# Altium project PCB_15122020_01BC.PrjPcb (part 7 of 9)

## Sheet PORT_EXPANDER.SchDoc
size A3
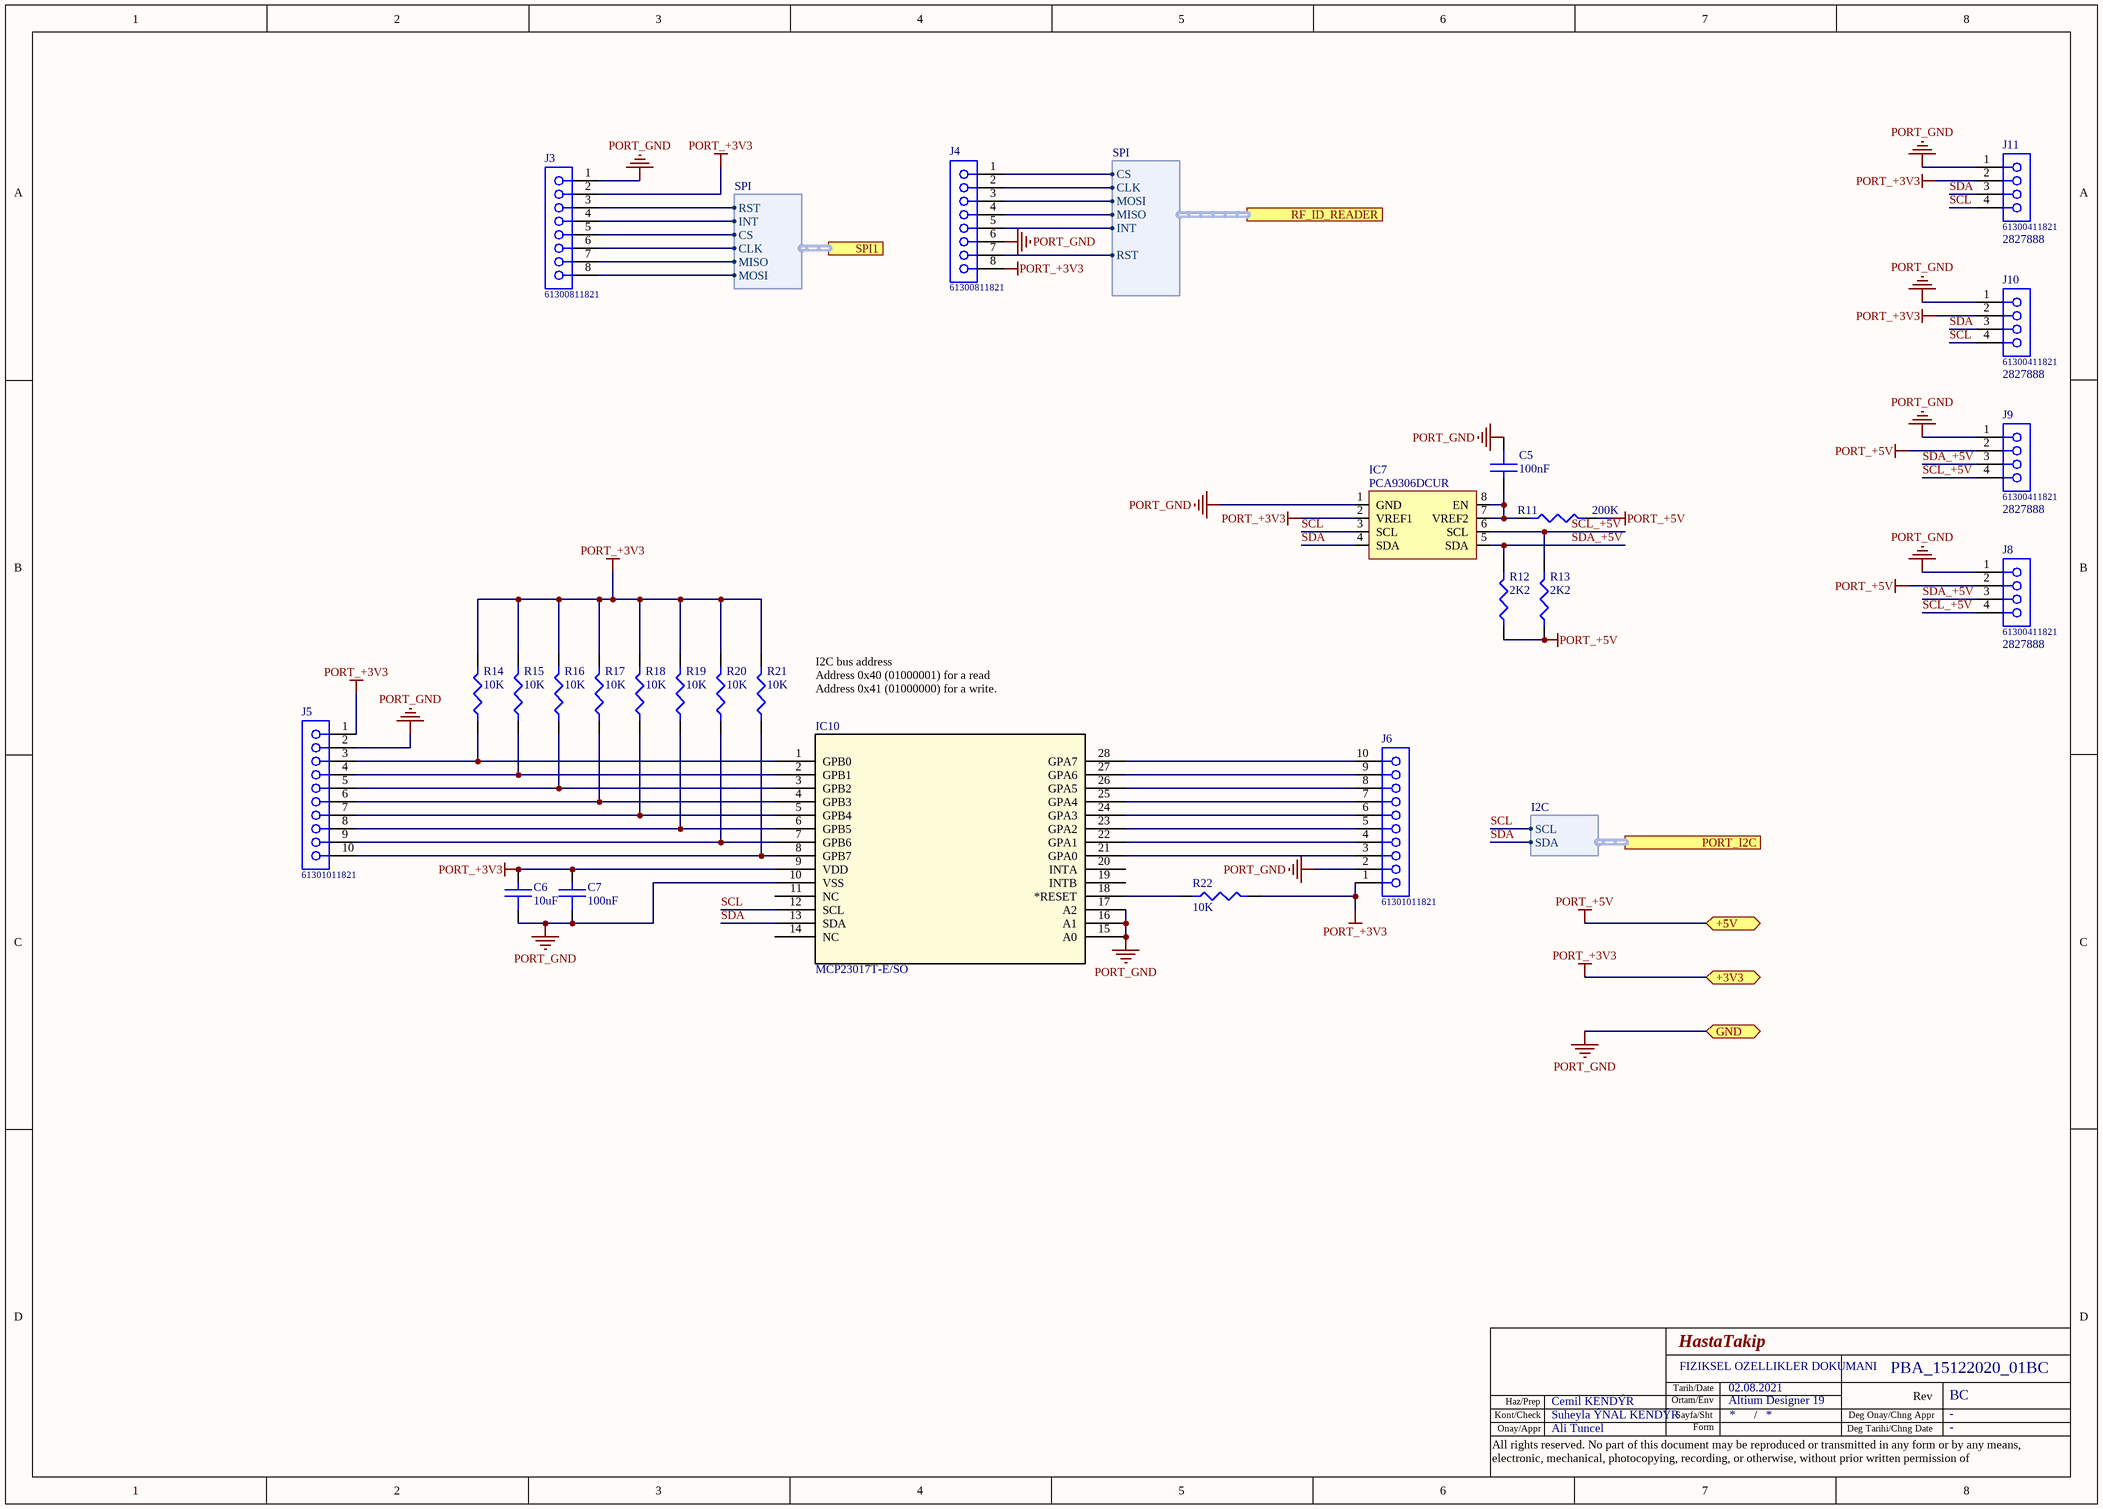
[diagram p6: PORT_EXPANDER.SchDoc]

### Parts
C5  100nF  [C0603]
C6  10uF  [C0603]
C7  100nF  [C0603]
IC7  PCA9306DCUR  [SOP50P310X90-8N]
IC10  MCP23017T-E/SO  [SOIC28-W_MC]
J3  61300811821  [61300811821]
J4  61300811821  [61300811821]
J5  61301011821  [61301011821]
J6  61301011821  [61301011821]
J8  61300411821  Supplier Part Number 1: 2827888  [61300411821]
J9  61300411821  Supplier Part Number 1: 2827888  [61300411821]
J10  61300411821  Supplier Part Number 1: 2827888  [61300411821]
J11  61300411821  Supplier Part Number 1: 2827888  [61300411821]
R11  200K  [R0603]
R12  2K2  [R0603]
R13  2K2  [R0603]
R14  10K  [R0603]
R15  10K  [R0603]
R16  10K  [R0603]
R17  10K  [R0603]
R18  10K  [R0603]
R19  10K  [R0603]
R20  10K  [R0603]
R21  10K  [R0603]
R22  10K  [R0603]

### Ports
+3V3 (bidir), +5V (bidir), GND (bidir), PORT_I2C (harness I2C), RF_ID_READER (harness SPI), SPI1 (harness SPI)

### Harnesses
I2C: SCL, SDA
SPI: MOSI, MISO, CLK, CS, INT, RST

### Nets
PORT_+3V3: C6.1 C7.1 IC7.2(VREF1) IC10.9(VDD) J3.2 J4.8 J5.1 J6.1 J10.2 J11.2 R14.2 R15.2 R16.2 R17.2 R18.2 R19.2 R20.2 R21.2 R22.2 ; port +3V3  [project net +3V3]
PORT_+5V: J8.2 J9.2 R11.2 R12.1 R13.1 ; port +5V  [project net +5V]
PORT_GND: C5.2 C6.2 C7.2 IC7.1(GND) IC10.10(VSS) IC10.15(A0) IC10.16(A1) IC10.17(A2) J3.1 J4.6 J5.2 J6.2 J8.1 J9.1 J10.1 J11.1 ; port GND  [project net GND]
GPIO04: J3.3 ; port SPI1.RST
GPIO09: J3.7 J4.4 ; port SPI1.MISO, port RF_ID_READER.MISO
GPIO10: J3.8 J4.3 ; port SPI1.MOSI, port RF_ID_READER.MOSI
GPIO11: J3.6 J4.2 ; port SPI1.CLK, port RF_ID_READER.CLK
GPIO16: J4.1 ; port RF_ID_READER.CS
GPIO17: J3.5 ; port SPI1.CS
GPIO18: J3.4 ; port SPI1.INT
GPIO20: J4.5 ; port RF_ID_READER.INT
GPIO21: J4.7 ; port RF_ID_READER.RST
SCL: IC7.3(SCL) IC10.12(SCL) J10.4 J11.4 ; port PORT_I2C.SCL  [project net GPIO03]
SCL_+5V: IC7.6(SCL) J8.4 J9.4 R13.2
SDA: IC7.4(SDA) IC10.13(SDA) J10.3 J11.3 ; port PORT_I2C.SDA  [project net GPIO02]
SDA_+5V: IC7.5(SDA) J8.3 J9.3 R12.2
NetC5_1: C5.1 IC7.7(VREF2) IC7.8(EN) R11.1
NetIC10_1: IC10.1(GPB0) J5.3 R14.1
NetIC10_2: IC10.2(GPB1) J5.4 R15.1
NetIC10_3: IC10.3(GPB2) J5.5 R16.1
NetIC10_4: IC10.4(GPB3) J5.6 R17.1
NetIC10_5: IC10.5(GPB4) J5.7 R18.1
NetIC10_6: IC10.6(GPB5) J5.8 R19.1
NetIC10_7: IC10.7(GPB6) J5.9 R20.1
NetIC10_8: IC10.8(GPB7) J5.10 R21.1
NetIC10_18: IC10.18(*RESET) R22.1
NetIC10_21: IC10.21(GPA0) J6.3
NetIC10_22: IC10.22(GPA1) J6.4
NetIC10_23: IC10.23(GPA2) J6.5
NetIC10_24: IC10.24(GPA3) J6.6
NetIC10_25: IC10.25(GPA4) J6.7
NetIC10_26: IC10.26(GPA5) J6.8
NetIC10_27: IC10.27(GPA6) J6.9
NetIC10_28: IC10.28(GPA7) J6.10

Not connected (* = marked no-connect by the designer): IC10 11(NC) 14(NC) 19(INTB) 20(INTA)

### Notes on the sheet
- I2C bus address
  Address 0x40 (01000001) for a read
  Address 0x41 (01000000) for a write.
- Tarih/Date
- Kont/Check
- Onay/Appr
- Haz/Prep
- Ortam/Env
- Sayfa/Sht
- Form
- /
- Deg Tarihi/Chng Date
- Deg Onay/Chng Appr
- Rev
- All rights reserved. No part of this document may be reproduced or transmitted in any form or by any means, electronic, mechanical, photocopying, recording, or otherwise, without prior written permission of

### Library data of the parts
C5 C7 = CC0603KRX7R8BB104: 100nF, 25V, X7R, 10%, 0603; Manufacturer: Yageo; Supplier 1: Digi-Key; Supplier Part Number 1: 311-1341-1-ND; Manufacturer Part Number: CC0603KRX7R8BB104; Stock 1: 10150433; Pricing 1: 1 = 0,10000, 10 = 0,04500, 50 = 0,02480, 100 = 0,02020, 500 = 0,01444, 1000 = 0,01134 (USD); RoHS: Yes; Mount: Surface Mount; Case/Package: 0603; Number of Pins: 2; Case Code (Imperial): 0603; Case Code (Metric): 1608; Min Operating Temperature: -55°C; Max Operating Temperature: 125°C; Capacitance: 100nF; Tolerance: 10%; Voltage Rating: 25V; Packaging: Tape and Reel; Package Quantity: 1; Voltage Rating (DC): 25V; Dielectric: X7R; Termination: SMD/SMT; Resistor Type: Ceramic; Voltage: 25V; Length: 1.6mm; Width: 0.8mm; Height: 0.8mm; Thickness: 0.035inch; Depth: 0.8mm; Radiation Hardening: No; REACH SVHC: Unknown; Lead Free: Lead Free; Halogen Free: Halogen Free; ComponentLink1URL: https://datasheet.ciiva.com/11786/0900766b80c10176-11786120.pdf?src-supplier=RSComponents; ComponentLink1Description: https://datasheet.ciiva.com/11786/0900766b80c10176-11786120.pdf?src-supplier=RSComponents; ComponentLink2URL: https://datasheet.ciiva.com/144/mlccorderingcode-144075.pdf?src-supplier=Digi-Key; ComponentLink2Description: https://datasheet.ciiva.com/144/mlccorderingcode-144075.pdf?src-supplier=Digi-Key; ComponentLink3URL: https://datasheet.ciiva.com/17434/upy-gphc-x7r-6-3v-to-50v-8-17434263.pdf?src-supplier=Avnet+Europe; ComponentLink3Description: https://datasheet.ciiva.com/17434/upy-gphc-x7r-6-3v-to-50v-8-17434263.pdf?src-supplier=Avnet+Europe; ComponentLink4URL: https://datasheet.ciiva.com/26829/getdatasheetpartid-403577-26829431.pdf?src-supplier=Verical; ComponentLink4Description: https://datasheet.ciiva.com/26829/getdatasheetpartid-403577-26829431.pdf?src-supplier=Verical; ComponentLink5URL: https://datasheet.ciiva.com/11587/upy-gphc-x7r-6-3v-to-50v-8-11587208.pdf?src-supplier=Avnet; ComponentLink5Description: https://datasheet.ciiva.com/11587/upy-gphc-x7r-6-3v-to-50v-8-11587208.pdf?src-supplier=Avnet; ComponentLink6URL: https://datasheet.ciiva.com/13389/upy-gphc-x7r-6-3v-to-50v-8-13389352.pdf?src-supplier=Mouser; ComponentLink6Description: https://datasheet.ciiva.com/13389/upy-gphc-x7r-6-3v-to-50v-8-13389352.pdf?src-supplier=Mouser; ComponentLink7URL: https://datasheet.ciiva.com/28450/1489800-28450584.pdf?src-supplier=Element14; ComponentLink7Description: https://datasheet.ciiva.com/28450/1489800-28450584.pdf?src-supplier=Element14; ComponentLink8URL: https://datasheet.ciiva.com/144/mlccorderingcode-144073.pdf?src-supplier=Digi-Key; ComponentLink8Description: https://datasheet.ciiva.com/144/mlccorderingcode-144073.pdf?src-supplier=Digi-Key; ComponentLink9URL: https://datasheet.ciiva.com/144/mlccorderingcode-144074.pdf?src-supplier=Digi-Key; ComponentLink9Description: https://datasheet.ciiva.com/144/mlccorderingcode-144074.pdf?src-supplier=Digi-Key; ComponentLink10URL: https://datasheet.ciiva.com/7978/1489800-7978155.pdf?src-supplier=Element14; ComponentLink10Description: https://datasheet.ciiva.com/7978/1489800-7978155.pdf?src-supplier=Element14; Category: Capasitor
C6 = CC0603MRX5R6BB106: as C12-C15 on sheet Power; Supplier 1: Digi-Key; Supplier Part Number 1: 311-1817-1-ND; Manufacturer Part Number: CC0603MRX5R6BB106; Stock 1: 209492; Pricing 1: 1 = 0,20000, 10 = 0,13700, 50 = 0,08200, 100 = 0,06920, 500 = 0,04736, 1000 = 0,04190 (USD); RoHS: Yes; Mount: Surface Mount; Case/Package: 0603; Case Code (Imperial): 0603; Case Code (Metric): 1608; Weight: 7.1E-05oz; Min Operating Temperature: -55°C; Max Operating Temperature: 85°C; Voltage Rating: 10V; Termination: SMD/SMT; Resistor Type: Ceramic; Dielectric: X5R; Tolerance: 20%; Packaging: Tape and Reel; Capacitance: 10uF; Voltage Rating (DC): 10V; Length: 0.063inch; Width: 0.031inch; Thickness: 0.035inch; Depth: 0.8mm; Lead Free: Lead Free; Halogen Free: Halogen Free; ComponentLink1URL: http://components.arrow.com/part/dataview/0323_03079270?src-supplier=Arrow+Europe; ComponentLink1Description: http://components.arrow.com/part/dataview/0323_03079270?src-supplier=Arrow+Europe; ComponentLink2URL: http://www.mouser.com/ds/2/447/UPY-GPHC_X5R_4V-to-50V_25-1131599.pdf?src-supplier=Mouser; ComponentLink2Description: http://www.mouser.com/ds/2/447/UPY-GPHC_X5R_4V-to-50V_25-1131599.pdf?src-supplier=Mouser; ComponentLink3URL: http://www.yageo.com/documents/recent/UPY-GPHC_X5R_4V-to-50V_25.pdf?src-supplier=Digi-Key; ComponentLink3Description: http://www.yageo.com/documents/recent/UPY-GPHC_X5R_4V-to-50V_25.pdf?src-supplier=Digi-Key; Category: Capasitor
IC7 = PCA9306DCUR: TEXAS INSTRUMENTS - PCA9306DCUR - 2 BIT VOLTAGE LEVEL TRANSLATOR VSSOP8; Number of Inputs: 2; Output Current: 64mA; Propagation Delay: 1.4ns; Min Supply Voltage: 0uV; Max Supply Voltage: 5V; Turn-On Delay Time: 1.2ns; Output Type: I2C; Supplier 1: Digi-Key; Supplier Part Number 1: 296-17988-1-ND; Manufacturer: Texas Instruments; Manufacturer Part Number: PCA9306DCUR; Stock 1: 19235; Pricing 1: 1 = 0,71000, 10 = 0,62700, 25 = 0,58920, 100 = 0,48070, 250 = 0,44652, 500 = 0,38000, 1000 = 0,30400 (USD); RoHS: Yes; Case/Package: VSSOP; Number of Pins: 8; Weight: 0.000339oz; Contact Plating: Gold; Min Operating Temperature: -40°C; Max Operating Temperature: 85°C; Packaging: Tape and Reel; Package Quantity: 1; Number of Channels: 2; Number of Outputs: 2; Logic Function: Translator; Number of Bits: 2; Termination: SMD/SMT; Length: 2.3mm; Width: 2mm; Height: 0.85mm; Radiation Hardening: No; REACH SVHC: No SVHC; Lead Free: Lead Free; ComponentLink1URL: https://datasheet.ciiva.com/36526/2030035-36526265.pdf?src-supplier=Jameco; ComponentLink1Description: https://datasheet.ciiva.com/36526/2030035-36526265.pdf?src-supplier=Jameco; ComponentLink2URL: https://datasheet.ciiva.com/1899/pca9306-1899329.pdf?src-supplier=Digi-Key; ComponentLink2Description: https://datasheet.ciiva.com/1899/pca9306-1899329.pdf?src-supplier=Digi-Key; ComponentLink3URL: https://datasheet.ciiva.com/1899/pca9306-1899330.pdf?src-supplier=Digi-Key; ComponentLink3Description: https://datasheet.ciiva.com/1899/pca9306-1899330.pdf?src-supplier=Digi-Key; ComponentLink4URL: https://datasheet.ciiva.com/1899/pca9306-1899331.pdf?src-supplier=Digi-Key; ComponentLink4Description: https://datasheet.ciiva.com/1899/pca9306-1899331.pdf?src-supplier=Digi-Key; ComponentLink5URL: https://datasheet.ciiva.com/14287/pca9306-14287462.pdf?src-supplier=Avnet; ComponentLink5Description: https://datasheet.ciiva.com/14287/pca9306-14287462.pdf?src-supplier=Avnet; ComponentLink6URL: https://datasheet.ciiva.com/1508/1815321-1508635.pdf?src-supplier=Element14; ComponentLink6Description: https://datasheet.ciiva.com/1508/1815321-1508635.pdf?src-supplier=Element14; ComponentLink7URL: https://datasheet.ciiva.com/1508/1862428-1508795.pdf?src-supplier=Element14; ComponentLink7Description: https://datasheet.ciiva.com/1508/1862428-1508795.pdf?src-supplier=Element14; Category: Integrated Circuits (ICs) Logic - Translators, Level Shifters
IC10 = MCP23017T-E/SO: IC I/O EXPANDER I2C 16B 28SOIC; Manufacturer: Microchip; Number of Channels: 1; Operating Supply Voltage: 5.5V; Nominal Supply Current: 1mA; Interface: I2C,Serial; Number of I/Os: 16; Frequency: 1.7MHz; Supplier 1: Digi-Key; Manufacturer Part Number: MCP23017T-E/SO; Stock 1: 9970; Pricing 1: 1 = 1,20000, 25 = 1,00000, 100 = 0,91000 (USD); RoHS: Yes; Case/Package: SOIC; Number of Pins: 28; Min Operating Temperature: -40°C; Max Operating Temperature: 125°C; Package Quantity: 1600; Packaging: Tape and Reel; Max Frequency: 1.7MHz; Number of Bits: 16; Lead Free: Lead Free; ComponentLink1URL: https://datasheet.ciiva.com/1780/21952b-1780728.pdf?src-supplier=Digi-Key; ComponentLink1Description: https://datasheet.ciiva.com/1780/21952b-1780728.pdf?src-supplier=Digi-Key; ComponentLink2URL: https://datasheet.ciiva.com/8128/21952b-8128585.pdf?src-supplier=Avnet; ComponentLink2Description: https://datasheet.ciiva.com/8128/21952b-8128585.pdf?src-supplier=Avnet; ComponentLink3URL: https://datasheet.ciiva.com/16454/filehandler-aspxddocname-en023709-16454265.pdf?src-supplier=Future+Electronics; ComponentLink3Description: https://datasheet.ciiva.com/16454/filehandler-aspxddocname-en023709-16454265.pdf?src-supplier=Future+Electronics; ComponentLink4URL: https://datasheet.ciiva.com/12267/21952b-12267564.pdf?src-supplier=Mouser; ComponentLink4Description: https://datasheet.ciiva.com/12267/21952b-12267564.pdf?src-supplier=Mouser; ComponentLink5URL: https://datasheet.ciiva.com/16617/21952b-16617631.pdf?src-supplier=Avnet+Europe; ComponentLink5Description: https://datasheet.ciiva.com/16617/21952b-16617631.pdf?src-supplier=Avnet+Europe; Supplier Part Number 1: MCP23017T-E/SOCT-ND; Category: Integrated Circuits Interface - I/O Expanders
J3 J4 = 61300811821: WR-PHD Socket Header, THT, pitch 2.54mm, Single Row, Vertical, 8pin; Manufacturer: Wurth Elektronik; Pin Number: 8; Gender: Female; Rated Current: 3A; Working Voltage: 250VAC; Withstanding Voltage: 500VAC; Contact Resistance: 20mOhm; ComponentLink1Description: Manufacturer; ComponentLink1URL: http://www.we-online.de; ComponentLink2Description: Datasheet; ComponentLink2URL: https://katalog.we-online.de/em/datasheet/6130xx11821.pdf; Part Number: 61300811821; Published Date: June 2019; Publisher: Wurth Elektronik; Pitch: 2.54mm; Operating Temperature: -40 to +125degC; Mounting Technology: THT; Packaging: Tray; Row Number: Single; Orientation: Vertical; Category: Connectors, Interconnects Rectangular Connectors
J5 J6 = 61301011821: WR-PHD Socket Header, THT, pitch 2.54mm, Single Row, Vertical, 10pin; Manufacturer: Wurth Elektronik; Pin Number: 10; Gender: Female; Rated Current: 3A; Working Voltage: 250VAC; Withstanding Voltage: 500VAC; Contact Resistance: 20mOhm; ComponentLink1Description: Manufacturer; ComponentLink1URL: http://www.we-online.de; ComponentLink2Description: Datasheet; ComponentLink2URL: https://katalog.we-online.de/em/datasheet/6130xx11821.pdf; Part Number: 61301011821; Published Date: June 2019; Publisher: Wurth Elektronik; Pitch: 2.54mm; Operating Temperature: -40 to +125degC; Mounting Technology: THT; Packaging: Tray; Row Number: Single; Orientation: Vertical; Category: Connectors, Interconnects Rectangular Connectors
J8-J11 = 61300411821: WR-PHD Socket Header, THT, pitch 2.54mm, Single Row, Vertical, 4pin; Manufacturer: Wurth Electronics; Pin Number: 4; Gender: Female; Rated Current: 3A; Working Voltage: 250VAC; Withstanding Voltage: 500VAC; Contact Resistance: 20mOhm; ComponentLink1Description: Manufacturer; ComponentLink1URL: http://www.we-online.de; ComponentLink2Description: Datasheet; ComponentLink2URL: https://katalog.we-online.de/em/datasheet/6130xx11821.pdf; Part Number: 61300411821; Published Date: June 2019; Publisher: Wurth Elektronik; Pitch: 2.54mm; Operating Temperature: -40 to +125degC; Mounting Technology: THT; Packaging: Tray; Row Number: Single; Orientation: Vertical; Supplier 1: Farnell; Manufacturer Part Number: 61300411821; Stock 1: 57; Pricing 1: 10 = 0,36400, 100 = 0,32400, 500 = 0,30300, 1000 = 0,29300, 2500 = 0,28300, 5000 = 0,27700 (EUR); RoHS: No; Contact Material: Copper Alloy; Category: Connectors, Interconnects Rectangular Connectors
R11 = RC0603FR-07200KL: 200K, %1, 1/10W, 0603; Manufacturer: Yageo; Resistance: 200kR; Tolerance: 1%; Temperature Coefficient: 100ppm/°C; Voltage Rating (DC): 50V; Power Rating: 100mW; Supplier 1: Digi-Key; Supplier Part Number 1: 311-200KHRCT-ND; Manufacturer Part Number: RC0603FR-07200KL; Stock 1: 1261743; Pricing 1: 1 = 0,10000, 10 = 0,02100, 100 = 0,00840, 1000 = 0,00379, 2500 = 0,00329 (USD); RoHS: Yes; Case/Package: 0603; Number of Pins: 2; Case Code (Metric): 1608; Case Code (Imperial): 0603; Min Operating Temperature: -55°C; Max Operating Temperature: 155°C; Packaging: Tape and Reel; Resistor Type: Thick Film; Voltage Rating: 50V; Package Quantity: 1; Number of Terminations: 2; Termination: SMD/SMT; Max Power Dissipation: 100mW; Features: Moisture Resistant; Length: 1.6mm; Width: 0.031inch; Height: 0.022inch; Depth: 0.8mm; Lead Free: Lead Free; REACH SVHC: No SVHC; Military Standard: Not; ComponentLink1URL: https://datasheet.ciiva.com/2453/pyu-r-int-thick-7-2453958.pdf?src-supplier=Digi-Key; ComponentLink1Description: https://datasheet.ciiva.com/2453/pyu-r-int-thick-7-2453958.pdf?src-supplier=Digi-Key; ComponentLink2URL: https://datasheet.ciiva.com/2453/pyu-r-int-thick-7-2453959.pdf?src-supplier=Digi-Key; ComponentLink2Description: https://datasheet.ciiva.com/2453/pyu-r-int-thick-7-2453959.pdf?src-supplier=Digi-Key; ComponentLink3URL: https://datasheet.ciiva.com/2453/pyu-r-int-thick-7-2453960.pdf?src-supplier=Digi-Key; ComponentLink3Description: https://datasheet.ciiva.com/2453/pyu-r-int-thick-7-2453960.pdf?src-supplier=Digi-Key; Category: Resistor
R12 R13 = RC0603FR-072K2L: 2K2, 1%, 0.1W, 0603; Manufacturer: Yageo; Resistance: 2.2kR; Power Rating: 100mW; Temperature Coefficient: 100ppm/°C; Voltage Rating: 50V; Supplier 1: Digi-Key; Supplier Part Number 1: 311-2.20KHRCT-ND; Manufacturer Part Number: RC0603FR-072K2L; Stock 1: 5062372; Pricing 1: 1 = 0,100000, 10 = 0,021000, 100 = 0,008400, 1000 = 0,003790, 2500 = 0,003290 (USD); RoHS: Yes; Case/Package: 0603; Case Code (Imperial): 0603; Case Code (Metric): 1608; Min Operating Temperature: -55°C; Max Operating Temperature: 155°C; Tolerance: 1%; Packaging: Tape and Reel; Package Quantity: 1; Termination: SMD/SMT; Resistor Type: Thick Film; Number of Terminations: 2; Max Power Dissipation: 100mW; Features: Moisture Resistant; Length: 1.6mm; Width: 0.031inch; Height: 0.022inch; Depth: 0.8mm; REACH SVHC: No SVHC; Lead Free: Lead Free; Military Standard: Not; ComponentLink1URL: https://datasheet.ciiva.com/46440/1868787-46440902.pdf?src-supplier=Element14; ComponentLink1Description: https://datasheet.ciiva.com/46440/1868787-46440902.pdf?src-supplier=Element14; ComponentLink2URL: https://datasheet.ciiva.com/2453/pyu-r-int-thick-7-2453943.pdf?src-supplier=Digi-Key; ComponentLink2Description: https://datasheet.ciiva.com/2453/pyu-r-int-thick-7-2453943.pdf?src-supplier=Digi-Key; ComponentLink3URL: https://datasheet.ciiva.com/7660/1868787-7660791.pdf?src-supplier=Element14; ComponentLink3Description: https://datasheet.ciiva.com/7660/1868787-7660791.pdf?src-supplier=Element14; ComponentLink4URL: https://datasheet.ciiva.com/2453/pyu-r-int-thick-7-2453944.pdf?src-supplier=Digi-Key; ComponentLink4Description: https://datasheet.ciiva.com/2453/pyu-r-int-thick-7-2453944.pdf?src-supplier=Digi-Key; ComponentLink5URL: https://datasheet.ciiva.com/2453/pyu-r-int-thick-7-2453945.pdf?src-supplier=Digi-Key; ComponentLink5Description: https://datasheet.ciiva.com/2453/pyu-r-int-thick-7-2453945.pdf?src-supplier=Digi-Key; ComponentLink6URL: https://datasheet.ciiva.com/7746/1738695-7746315.pdf?src-supplier=Element14; ComponentLink6Description: https://datasheet.ciiva.com/7746/1738695-7746315.pdf?src-supplier=Element14; ComponentLink7URL: https://datasheet.ciiva.com/7746/1738695-7746316.pdf?src-supplier=Element14; ComponentLink7Description: https://datasheet.ciiva.com/7746/1738695-7746316.pdf?src-supplier=Element14; ComponentLink8URL: https://datasheet.ciiva.com/46394/443971-46394958.pdf?src-supplier=Element14; ComponentLink8Description: https://datasheet.ciiva.com/46394/443971-46394958.pdf?src-supplier=Element14; Category: Resistor
R14-R22 = RT0603FRE0710KL: 10K OHM 1% 1/10W 0603; Manufacturer: Yageo; Resistance: 10kR; Power Rating: 100mW; Voltage Rating: 75V; Temperature Coefficient: 50ppm/°C; Supplier 1: Digi-Key; Supplier Part Number 1: YAG2321CT-ND; Manufacturer Part Number: RT0603FRE0710KL; Stock 1: 326134; Pricing 1: 1 = 0,10000, 10 = 0,05600, 100 = 0,02270, 1000 = 0,01020, 2500 = 0,00886 (USD); RoHS: Yes; Case/Package: 0603; Number of Pins: 2; Case Code (Metric): 1608; Case Code (Imperial): 0603; Contact Plating: Tin,Lead; Min Operating Temperature: -55°C; Max Operating Temperature: 125°C; Package Quantity: 5000; Packaging: Tape and Reel; Tolerance: 1%; Resistor Type: Thin Film; Number of Terminations: 2; Termination: SMD/SMT; Max Power Dissipation: 100mW; Voltage Rating (DC): 75V; Features: Moisture Resistant; Length: 0.063inch; Width: 0.031inch; Height: 0.022inch; Depth: 0.8mm; REACH SVHC: Unknown; Military Standard: Not; Lead Free: Lead Free; ComponentLink1URL: https://datasheet.ciiva.com/2559/pyu-rt-1-to-0-05-rohs-l-5-2559482.pdf?src-supplier=Digi-Key; ComponentLink1Description: https://datasheet.ciiva.com/2559/pyu-rt-1-to-0-05-rohs-l-5-2559482.pdf?src-supplier=Digi-Key; ComponentLink2URL: https://datasheet.ciiva.com/16745/pyu-rt-1-to-0-05-rohs-l-4-16745739.pdf?src-supplier=Future+Electronics; ComponentLink2Description: https://datasheet.ciiva.com/16745/pyu-rt-1-to-0-05-rohs-l-4-16745739.pdf?src-supplier=Future+Electronics; ComponentLink3URL: https://datasheet.ciiva.com/12694/pyu-rt-1-to-0-05-rohs-l-4-12694910.pdf?src-supplier=Mouser; ComponentLink3Description: https://datasheet.ciiva.com/12694/pyu-rt-1-to-0-05-rohs-l-4-12694910.pdf?src-supplier=Mouser; Category: Resistor

## Sheet SENSORS.SchDoc
size A3
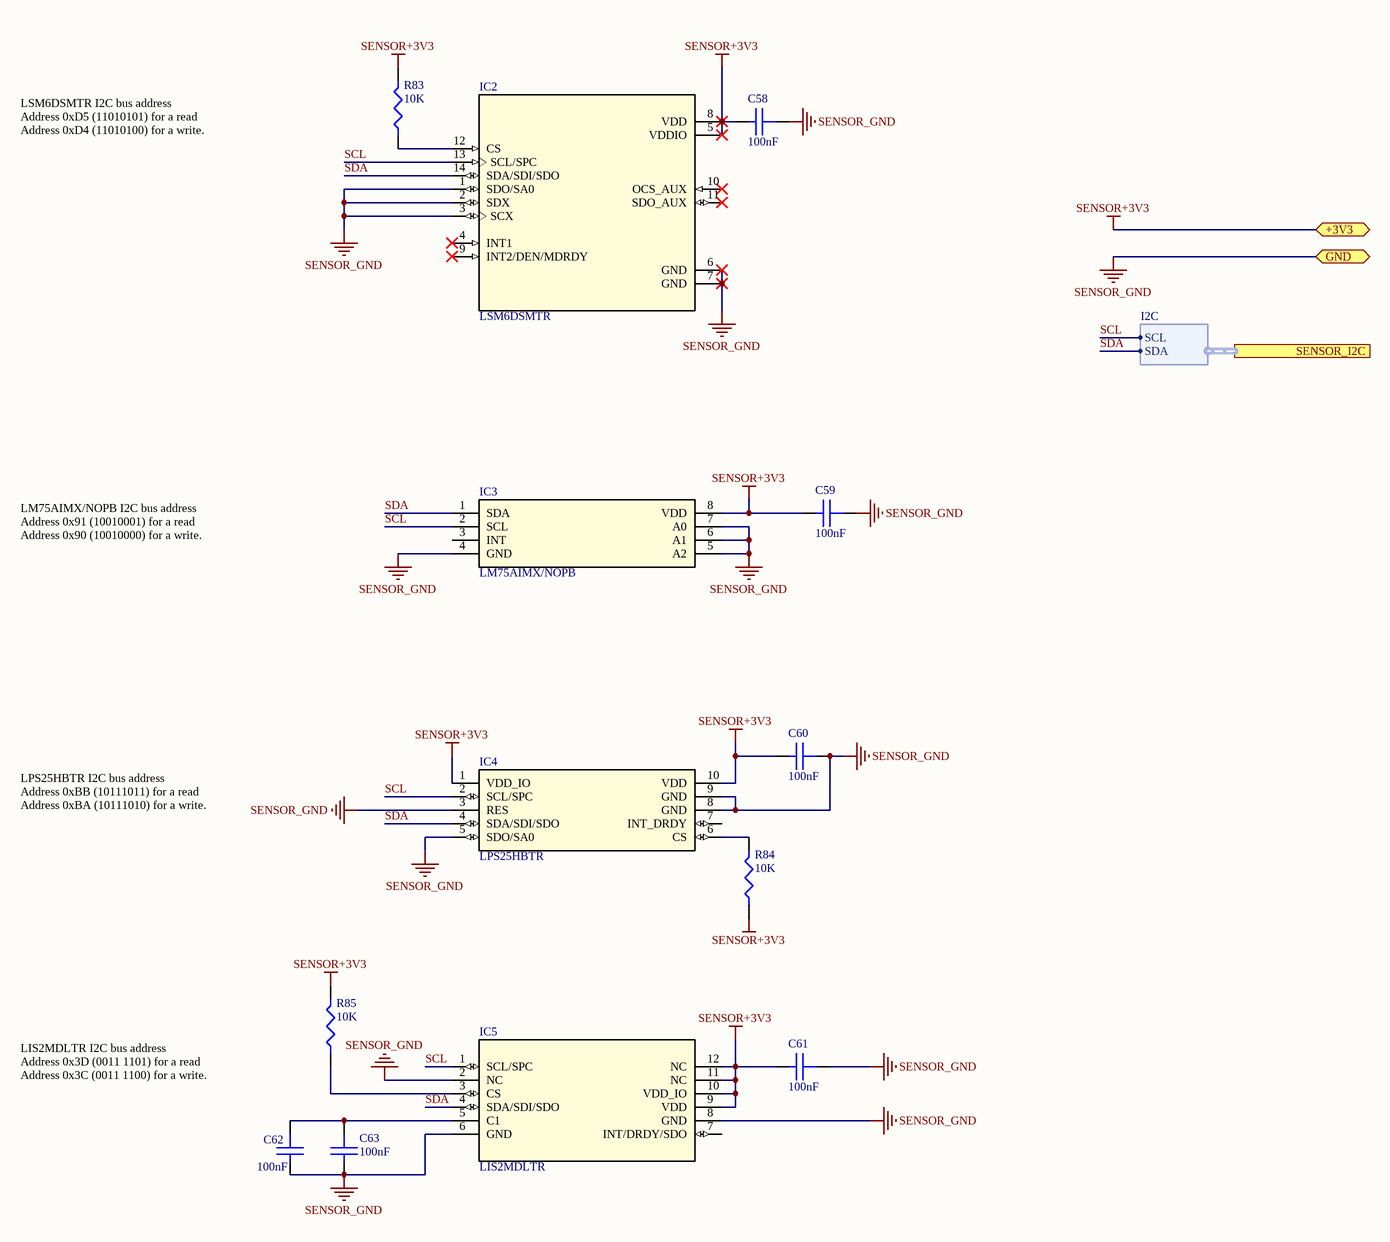
[diagram p7: SENSORS.SchDoc]

### Parts
C58  100nF  [C0603]
C59  100nF  [C0603]
C60  100nF  [C0603]
C61  100nF  [C0603]
C62  100nF  [C0603]
C63  100nF  [C0603]
IC2  LSM6DSMTR  [PQFN50P300X250X86-14N]
IC3  LM75AIMX/NOPB  [SO08]
IC4  LPS25HBTR  [HLGA10_2P5X2P5]
IC5  LIS2MDLTR  [LGA12]
R83  10K  [R0603]
R84  10K  [R0603]
R85  10K  [R0603]

### Ports
+3V3 (bidir), GND (bidir), SENSOR_I2C (harness I2C)

### Harnesses
I2C: SCL, SDA

### Nets
SENSOR+3V3: C58.1 C59.1 C60.1 C61.1 IC2.5(VDDIO) IC2.8(VDD) IC3.8(VDD) IC4.1(VDD_IO) IC4.10(VDD) IC5.9(VDD) IC5.10(VDD_IO) IC5.11(NC) IC5.12(NC) R83.2 R84.1 R85.2 ; port +3V3  [project net +3V3]
SENSOR_GND: C58.2 C59.2 C60.2 C61.2 C62.1 C63.1 IC2.1(SDO/SA0) IC2.2(SDX) IC2.3(SCX) IC2.6(GND) IC2.7(GND) IC3.4(GND) IC3.5(A2) IC3.6(A1) IC3.7(A0) IC4.3(RES) IC4.5(SDO/SA0) IC4.8(GND) IC4.9(GND) IC5.2(NC) IC5.6(GND) IC5.8(GND) ; port GND  [project net GND]
SCL: IC2.13(SCL/SPC) IC3.2(SCL) IC4.2(SCL/SPC) IC5.1(SCL/SPC) ; port SENSOR_I2C.SCL  [project net GPIO03]
SDA: IC2.14(SDA/SDI/SDO) IC3.1(SDA) IC4.4(SDA/SDI/SDO) IC5.4(SDA/SDI/SDO) ; port SENSOR_I2C.SDA  [project net GPIO02]
NetC62_2: C62.2 C63.2 IC5.5(C1)
NetIC2_12: IC2.12(CS) R83.1
NetIC4_6: IC4.6(CS) R84.2
NetIC5_3: IC5.3(CS) R85.1

Not connected (* = marked no-connect by the designer): IC2 4(INT1)* 9(INT2/DEN/MDRDY)* 10(OCS_AUX)* 11(SDO_AUX)*; IC3 3(INT); IC4 7(INT_DRDY); IC5 7(INT/DRDY/SDO)

### Notes on the sheet
- LSM6DSMTR I2C bus address
  Address 0xD5 (11010101) for a read
  Address 0xD4 (11010100) for a write.
- LM75AIMX/NOPB I2C bus address
  Address 0x91 (10010001) for a read
  Address 0x90 (10010000) for a write.
- LPS25HBTR I2C bus address
  Address 0xBB (10111011) for a read
  Address 0xBA (10111010) for a write.
- LIS2MDLTR I2C bus address
  Address 0x3D (0011 1101) for a read
  Address 0x3C (0011 1100) for a write.
- Tarih/Date
- Kont/Check
- Onay/Appr
- Haz/Prep
- Ortam/Env
- Sayfa/Sht
- Form
- /
- Deg Tarihi/Chng Date
- Deg Onay/Chng Appr
- Rev
- All rights reserved. No part of this document may be reproduced or transmitted in any form or by any means, electronic, mechanical, photocopying, recording, or otherwise, without prior written permission of

### Library data of the parts
C58-C63 = CC0603KRX7R8BB104: as C5 on sheet PORT_EXPANDER; Supplier 1: Digi-Key; Supplier Part Number 1: 311-1341-1-ND; Manufacturer Part Number: CC0603KRX7R8BB104; Stock 1: 10150433; Pricing 1: 1 = 0,10000, 10 = 0,04500, 50 = 0,02480, 100 = 0,02020, 500 = 0,01444, 1000 = 0,01134 (USD); RoHS: Yes; Mount: Surface Mount; Case/Package: 0603; Number of Pins: 2; Case Code (Imperial): 0603; Case Code (Metric): 1608; Min Operating Temperature: -55°C; Max Operating Temperature: 125°C; Capacitance: 100nF; Tolerance: 10%; Voltage Rating: 25V; Packaging: Tape and Reel; Package Quantity: 1; Voltage Rating (DC): 25V; Dielectric: X7R; Termination: SMD/SMT; Resistor Type: Ceramic; Voltage: 25V; Length: 1.6mm; Width: 0.8mm; Height: 0.8mm; Thickness: 0.035inch; Depth: 0.8mm; Radiation Hardening: No; REACH SVHC: Unknown; Lead Free: Lead Free; Halogen Free: Halogen Free; ComponentLink1URL: https://datasheet.ciiva.com/11786/0900766b80c10176-11786120.pdf?src-supplier=RSComponents; ComponentLink1Description: https://datasheet.ciiva.com/11786/0900766b80c10176-11786120.pdf?src-supplier=RSComponents; ComponentLink2URL: https://datasheet.ciiva.com/144/mlccorderingcode-144075.pdf?src-supplier=Digi-Key; ComponentLink2Description: https://datasheet.ciiva.com/144/mlccorderingcode-144075.pdf?src-supplier=Digi-Key; ComponentLink3URL: https://datasheet.ciiva.com/17434/upy-gphc-x7r-6-3v-to-50v-8-17434263.pdf?src-supplier=Avnet+Europe; ComponentLink3Description: https://datasheet.ciiva.com/17434/upy-gphc-x7r-6-3v-to-50v-8-17434263.pdf?src-supplier=Avnet+Europe; ComponentLink4URL: https://datasheet.ciiva.com/26829/getdatasheetpartid-403577-26829431.pdf?src-supplier=Verical; ComponentLink4Description: https://datasheet.ciiva.com/26829/getdatasheetpartid-403577-26829431.pdf?src-supplier=Verical; ComponentLink5URL: https://datasheet.ciiva.com/11587/upy-gphc-x7r-6-3v-to-50v-8-11587208.pdf?src-supplier=Avnet; ComponentLink5Description: https://datasheet.ciiva.com/11587/upy-gphc-x7r-6-3v-to-50v-8-11587208.pdf?src-supplier=Avnet; ComponentLink6URL: https://datasheet.ciiva.com/13389/upy-gphc-x7r-6-3v-to-50v-8-13389352.pdf?src-supplier=Mouser; ComponentLink6Description: https://datasheet.ciiva.com/13389/upy-gphc-x7r-6-3v-to-50v-8-13389352.pdf?src-supplier=Mouser; ComponentLink7URL: https://datasheet.ciiva.com/28450/1489800-28450584.pdf?src-supplier=Element14; ComponentLink7Description: https://datasheet.ciiva.com/28450/1489800-28450584.pdf?src-supplier=Element14; ComponentLink8URL: https://datasheet.ciiva.com/144/mlccorderingcode-144073.pdf?src-supplier=Digi-Key; ComponentLink8Description: https://datasheet.ciiva.com/144/mlccorderingcode-144073.pdf?src-supplier=Digi-Key; ComponentLink9URL: https://datasheet.ciiva.com/144/mlccorderingcode-144074.pdf?src-supplier=Digi-Key; ComponentLink9Description: https://datasheet.ciiva.com/144/mlccorderingcode-144074.pdf?src-supplier=Digi-Key; ComponentLink10URL: https://datasheet.ciiva.com/7978/1489800-7978155.pdf?src-supplier=Element14; ComponentLink10Description: https://datasheet.ciiva.com/7978/1489800-7978155.pdf?src-supplier=Element14; Category: Capasitor
IC2 = LSM6DSMTR: IMU ACCEL/GYRO I2C/SPI 14LGA; Manufacturer: STMicroelectronics; Min Supply Voltage: 1.71V; Max Supply Voltage: 3.6V; ComponentLink1URL: http://www.farnell.com/datasheets/2151220.pdf?src-supplier=Farnell; ComponentLink1Description: http://www.farnell.com/datasheets/2151220.pdf?src-supplier=Farnell; ComponentLink2URL: https://www.mouser.com/ds/2/389/lsm6dsm-973702.pdf?src-supplier=Mouser; ComponentLink2Description: https://www.mouser.com/ds/2/389/lsm6dsm-973702.pdf?src-supplier=Mouser; ComponentLink3URL: http://www.st.com/content/ccc/resource/technical/document/datasheet/76/27/cf/88/c5/03/42/6b/DM00218116.pdf/files/DM00218116.pdf/jcr:content/translations/en.DM00218116.pdf?src-supplier=Digi-Key; ComponentLink3Description: http://www.st.com/content/ccc/resource/technical/document/datasheet/76/27/cf/88/c5/03/42/6b/DM00218116.pdf/files/DM00218116.pdf/jcr:content/translations/en.DM00218116.pdf?src-supplier=Digi-Key; ComponentLink4URL: http://www.farnell.com/datasheets/2151220.pdf?src-supplier=Element14; ComponentLink4Description: http://www.farnell.com/datasheets/2151220.pdf?src-supplier=Element14; ComponentLink5URL: http://www.st.com/content/ccc/resource/sales_and_marketing/promotional_material/flyer/7a/04/ee/af/e2/19/46/66/fllsm6dsm0216.pdf/files/fllsm6dsm0216.pdf/jcr:content/translations/en.fllsm6dsm0216.pdf?src-supplier=Digi-Key; ComponentLink5Description: http://www.st.com/content/ccc/resource/sales_and_marketing/promotional_material/flyer/7a/04/ee/af/e2/19/46/66/fllsm6dsm0216.pdf/files/fllsm6dsm0216.pdf/jcr:content/translations/en.fllsm6dsm0216.pdf?src-supplier=Digi-Key; Category: Sensors, Transducers; Supplier 1: Digi-Key; Manufacturer Part Number: LSM6DSMTR; Stock 1: 5847; Pricing 1: 1 = 3,00000, 10 = 2,69700, 25 = 2,54920, 100 = 2,09610, 250 = 1,88080, 500 = 1,81280, 1000 = 1,50689, 2500 = 1,45024 (USD); RoHS: No; Case/Package: LGA; Number of Pins: 14; Packaging: Cut Tape; REACH SVHC: No SVHC; Supplier Part Number 1: 497-16696-6-ND
IC3 = LM75AIMX/NOPB: SENSOR DIGITAL -55C-125C 8SOIC; Manufacturer: TI National Semiconductor; Interface: I2C,SMBus,2-Wire; Max Supply Voltage: 5.5V; Min Supply Voltage: 2.7V; Output Current: 1uA; Resolution: 9b; Operating Supply Current: 280uA; Quiescent Current: 500uA; Number of Bits: 9; Output Type: I2C,Digital; Supplier 1: Digi-Key; Manufacturer Part Number: LM75AIMX/NOPB; Stock 1: 21295; Pricing 1: 1 = 1,81000, 5 = 1,74200, 10 = 1,41600, 25 = 1,21960, 50 = 1,05640, 100 = 0,95830, 500 = 0,80586, 1000 = 0,71874 (USD); RoHS: Yes; Mount: Surface Mount; Case/Package: SOIC; Number of Pins: 8; Contact Plating: Tin; Min Operating Temperature: -55°C; Max Operating Temperature: 125°C; Packaging: Tape and Reel; Package Quantity: 2500; Max Supply Voltage (DC): 5.5V; Min Supply Voltage (DC): 2.7V; Radiation Hardening: No; REACH SVHC: No SVHC; Lead Free: Lead Free; ComponentLink1URL: https://datasheet.ciiva.com/3277/lm75a-3277942.pdf?src-supplier=Avnet; ComponentLink1Description: https://datasheet.ciiva.com/3277/lm75a-3277942.pdf?src-supplier=Avnet; ComponentLink2URL: https://datasheet.ciiva.com/46417/1841923-46417014.pdf?src-supplier=Element14; ComponentLink2Description: https://datasheet.ciiva.com/46417/1841923-46417014.pdf?src-supplier=Element14; ComponentLink3URL: https://datasheet.ciiva.com/6598/lm75a-6598537.pdf?src-supplier=Digi-Key; ComponentLink3Description: https://datasheet.ciiva.com/6598/lm75a-6598537.pdf?src-supplier=Digi-Key; ComponentLink4URL: https://datasheet.ciiva.com/6598/lm75a-6598538.pdf?src-supplier=Digi-Key; ComponentLink4Description: https://datasheet.ciiva.com/6598/lm75a-6598538.pdf?src-supplier=Digi-Key; ComponentLink5URL: https://datasheet.ciiva.com/6598/lm75a-6598539.pdf?src-supplier=Digi-Key; ComponentLink5Description: https://datasheet.ciiva.com/6598/lm75a-6598539.pdf?src-supplier=Digi-Key; Supplier Part Number 1: LM75AIMX/NOPBCT-ND; Category: Sensors, Transducers
IC4 = LPS25HBTR: IC MEMS PRESSURE SENSOR 10HCLGA; Manufacturer: STMicroelectronics; Operating Pressure: 18.27PSI; Port Style: No Port; Max Pressure: 290.08PSI; Min Supply Voltage: 1.7V; Max Supply Voltage: 3.6V; Output Type: SPI,I2C; Pressure Type: Absolute; Supplier 1: Digi-Key; Manufacturer Part Number: LPS25HBTR; Stock 1: 1317; Pricing 1: 1 = 4,05000, 10 = 3,63900, 25 = 3,44040, 100 = 2,98160, 500 = 2,53814, 1000 = 2,14060 (USD); RoHS: Yes; Mount: Surface Mount; Number of Pins: 10; Contact Plating: Gold; Min Operating Temperature: -30°C; Max Operating Temperature: 105°C; Termination: Solder; REACH SVHC: No SVHC; Lead Free: Lead Free; ComponentLink1URL: http://www.farnell.com/datasheets/2309000.pdf?src-supplier=Farnell; ComponentLink1Description: http://www.farnell.com/datasheets/2309000.pdf?src-supplier=Farnell; ComponentLink2URL: https://www.mouser.com/ds/2/389/lps25hb-954985.pdf?src-supplier=Mouser; ComponentLink2Description: https://www.mouser.com/ds/2/389/lps25hb-954985.pdf?src-supplier=Mouser; ComponentLink3URL: http://www.st.com/content/ccc/resource/technical/document/datasheet/9a/4c/aa/72/1f/45/4e/24/DM00141379.pdf/files/DM00141379.pdf/jcr:content/translations/en.DM00141379.pdf?src-supplier=Digi-Key; ComponentLink3Description: http://www.st.com/content/ccc/resource/technical/document/datasheet/9a/4c/aa/72/1f/45/4e/24/DM00141379.pdf/files/DM00141379.pdf/jcr:content/translations/en.DM00141379.pdf?src-supplier=Digi-Key; ComponentLink4URL: http://www.farnell.com/datasheets/2309000.pdf?src-supplier=Newark; ComponentLink4Description: http://www.farnell.com/datasheets/2309000.pdf?src-supplier=Newark; ComponentLink5URL: http://www.farnell.com/datasheets/1992925.pdf?src-supplier=Element14; ComponentLink5Description: http://www.farnell.com/datasheets/1992925.pdf?src-supplier=Element14; ComponentLink6URL: http://www.st.com/st-web-ui/static/active/en/resource/technical/document/datasheet/DM00141379.pdf?src-supplier=Avnet; ComponentLink6Description: http://www.st.com/st-web-ui/static/active/en/resource/technical/document/datasheet/DM00141379.pdf?src-supplier=Avnet; ComponentLink7URL: http://www.st.com/st-web-ui/static/active/en/resource/technical/document/datasheet/DM00141379.pdf?src-supplier=Avnet+Asia; ComponentLink7Description: http://www.st.com/st-web-ui/static/active/en/resource/technical/document/datasheet/DM00141379.pdf?src-supplier=Avnet+Asia; Category: Sensors, Transducers; Stock 2: 757; Pricing 2: 1 = 4,05000, 10 = 3,63900, 25 = 3,44040, 100 = 2,98160, 500 = 2,53814, 1000 = 2,14060 (USD); Supplier Part Number 1: 497-15070-1-ND
IC5 = LIS2MDLTR: ULTRA-COMPACT HIGH-PERFORMANCE E; Manufacturer: STMicroelectronics; Supplier 1: Digi-Key; Manufacturer Part Number: LIS2MDLTR; Stock 1: 20734; Pricing 1: 1 = 1,95000, 10 = 1,74900, 25 = 1,65000, 100 = 1,40580, 500 = 1,15500, 1000 = 0,95700, 5000 = 0,85800 (USD); RoHS: No; ComponentLink1URL: http://www.st.com/content/ccc/resource/technical/document/datasheet/group3/29/13/d1/e0/9a/4d/4f/30/DM00395193/files/DM00395193.pdf/jcr:content/translations/en.DM00395193.pdf?src-supplier=Digi-Key; ComponentLink1Description: http://www.st.com/content/ccc/resource/technical/document/datasheet/group3/29/13/d1/e0/9a/4d/4f/30/DM00395193/files/DM00395193.pdf/jcr:content/translations/en.DM00395193.pdf?src-supplier=Digi-Key; Supplier Part Number 1: 497-17588-6-ND; Category: Sensors, Transducers
R83-R85 = RT0603FRE0710KL: as R14 on sheet PORT_EXPANDER; Supplier 1: Digi-Key; Supplier Part Number 1: YAG2321CT-ND; Manufacturer Part Number: RT0603FRE0710KL; Stock 1: 326134; Pricing 1: 1 = 0,10000, 10 = 0,05600, 100 = 0,02270, 1000 = 0,01020, 2500 = 0,00886 (USD); RoHS: Yes; Case/Package: 0603; Number of Pins: 2; Case Code (Metric): 1608; Case Code (Imperial): 0603; Contact Plating: Tin,Lead; Min Operating Temperature: -55°C; Max Operating Temperature: 125°C; Package Quantity: 5000; Packaging: Tape and Reel; Tolerance: 1%; Resistor Type: Thin Film; Number of Terminations: 2; Termination: SMD/SMT; Max Power Dissipation: 100mW; Voltage Rating (DC): 75V; Features: Moisture Resistant; Length: 0.063inch; Width: 0.031inch; Height: 0.022inch; Depth: 0.8mm; REACH SVHC: Unknown; Military Standard: Not; Lead Free: Lead Free; ComponentLink1URL: https://datasheet.ciiva.com/2559/pyu-rt-1-to-0-05-rohs-l-5-2559482.pdf?src-supplier=Digi-Key; ComponentLink1Description: https://datasheet.ciiva.com/2559/pyu-rt-1-to-0-05-rohs-l-5-2559482.pdf?src-supplier=Digi-Key; ComponentLink2URL: https://datasheet.ciiva.com/16745/pyu-rt-1-to-0-05-rohs-l-4-16745739.pdf?src-supplier=Future+Electronics; ComponentLink2Description: https://datasheet.ciiva.com/16745/pyu-rt-1-to-0-05-rohs-l-4-16745739.pdf?src-supplier=Future+Electronics; ComponentLink3URL: https://datasheet.ciiva.com/12694/pyu-rt-1-to-0-05-rohs-l-4-12694910.pdf?src-supplier=Mouser; ComponentLink3Description: https://datasheet.ciiva.com/12694/pyu-rt-1-to-0-05-rohs-l-4-12694910.pdf?src-supplier=Mouser; Category: Resistor